# Altium schematic sheet OUTPUTS.SchDoc
size A
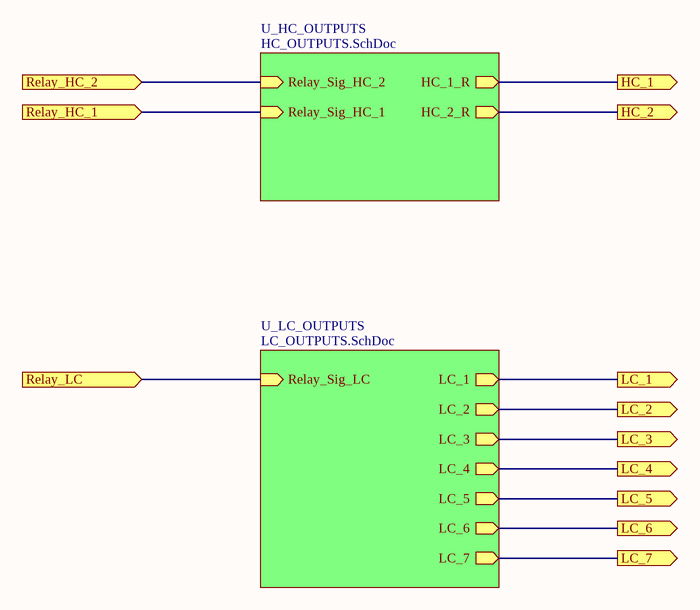
[diagram p0: OUTPUTS.SchDoc]

## Sub-sheets
U_HC_OUTPUTS = HC_OUTPUTS.SchDoc: Relay_Sig_HC_2 (in), Relay_Sig_HC_1 (in), HC_1_R (out), HC_2_R (out)
U_LC_OUTPUTS = LC_OUTPUTS.SchDoc: LC_1 (out), LC_2 (out), LC_3 (out), LC_4 (out), LC_5 (out), LC_6 (out), LC_7 (out), Relay_Sig_LC (in)

## Ports
HC_1 (out), HC_2 (out), LC_1 (out), LC_2 (out), LC_3 (out), LC_4 (out), LC_5 (out), LC_6 (out), LC_7 (out), Relay_HC_1 (in), Relay_HC_2 (in), Relay_LC (in)

## Nets
HC_1: port HC_1, sheet U_HC_OUTPUTS/HC_1_R
HC_2: port HC_2, sheet U_HC_OUTPUTS/HC_2_R
LC_1: port LC_1, sheet U_LC_OUTPUTS/LC_1
LC_2: port LC_2, sheet U_LC_OUTPUTS/LC_2
LC_3: port LC_3, sheet U_LC_OUTPUTS/LC_3
LC_4: port LC_4, sheet U_LC_OUTPUTS/LC_4
LC_5: port LC_5, sheet U_LC_OUTPUTS/LC_5
LC_6: port LC_6, sheet U_LC_OUTPUTS/LC_6
LC_7: port LC_7, sheet U_LC_OUTPUTS/LC_7
Relay_HC_1: port Relay_HC_1, sheet U_HC_OUTPUTS/Relay_Sig_HC_1
Relay_HC_2: port Relay_HC_2, sheet U_HC_OUTPUTS/Relay_Sig_HC_2
Relay_LC: port Relay_LC, sheet U_LC_OUTPUTS/Relay_Sig_LC